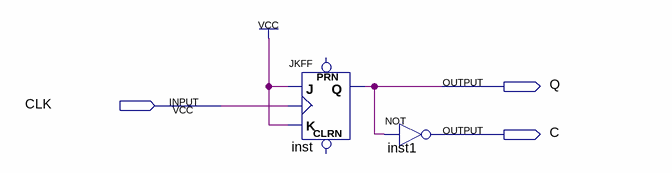
[diagram p0: schematic sheet]
// Quartus schematic DiagCont2.bdf as structural Verilog: 2 symbols, 3 pins
module DiagCont2 (
  input  CLK,
  output Q,
  output C
);

  JKFF inst (.K(1'b1), .J(1'b1), .CLK(CLK), .Q(Q));  // open: PRN, CLRN
  not inst1 (C, Q);
endmodule
